# Altium schematic sheet LED.SchDoc
size A4; Engineer: Alisya K.; Organization: ORGANIZATION; Address1: ADDRESS 1; Address2: ADDRESS 2; Address3: ADDRESS 3; Address4: ADDRESS 4; Revision: -; Project: LED Chaser; ENG_APP_DATE: --/--/--; DSN_APP_DATE: --/--/--; CHK_APP_DATE: --/--/--; SchTitle: LED; SchBrief: Running LED lights circuit design.
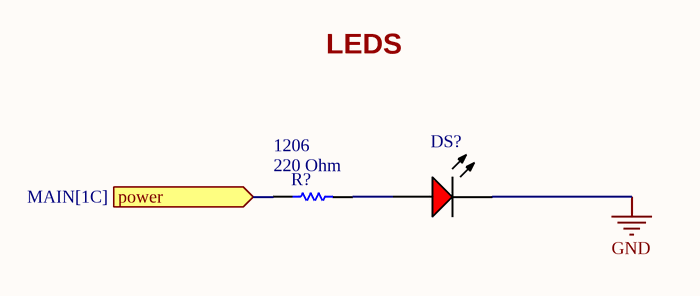
[diagram p0: LED.SchDoc]

## Parts
DS?  HSMH-C150  [AVAG-HSMX-C150_V]  (value not drawn)
R?  CRCW1206220RFKEA  [RESC3216X60X45ML10T20]  (value not drawn)

## Ports
power (in, see MAIN[1C])

## Nets
GND: DS?.2(K)
power: R?.1 ; port power
NetDS?_1: DS?.1(A) R?.2

## Notes on the sheet
- LEDS
- (near R?) 220 Ohm
- (near R?) 1206
- DOCUMENT
- PROJECT
- MODIFIED
- REVISION
- ENGINEER
- REVIEWER
- SHEET #

## Library data of the parts
DS? = CMP-2000-06426-1: LED Uni-Color Red, 65 mW, 25 mA, -40 to 85 degC, 2-Pin SMD, RoHS, Tape and Reel; Manufacturer: Avago; Product Height (mm): 1.1mm; Power Dissipation: 78W; Product Length (mm): 3.2mm; Forward Voltage: 2.6V; Luminous Intensity: 17mcd; DELETED: Compliant; Shape Type: Rectangular; Peak Wavelength: 660nm; Main Category: ChipLED; Dominant Wave Length: 639nm; Rad Hardened: No; Lens Type: ColorlessDiffused; Product Depth (mm): 1.6mm; Reverse Voltage: 5V; Forward Current: 25mA; Chip Material: GaAlAs; Test Current (It): 20mA; Viewing Angle: 170deg; Number of  Elements: 1; Type: Uni-Color; Package Reference: HSMX-C150; Package Description: 2-Pin Surface Mount Device, Body 3.2 x 1.6 mm; Operating Temp Range: -40Cto85C; Mounting: SurfaceMount; Emitting Color: Red; Pin Count: 2; Operating Temperature Classification: Industrial; Datasheet URL: http://media.digikey.com/pdf/Data%20Sheets/Avago%20PDFs/HSMz-Czzz.pdf; Package Type: ChipLed; Mounting Technology: SurfaceMount; High Brightness: No; Lens Dimensions: 2x1.6x0.6mm; Manufacturer URL: http://www.avagotech.com/; Lum Intensity: 17mcd; Datasheet Version: 03/2012; Packaging: TapeandReel
R? = CMP-2003-01956-1: Manufacturer: Vishay Dale; Part Number: CRCW1206220RFKEA